# EAGLE design design-1v1 (EAGLE 9.5.1)

## Sheet 1 of 2
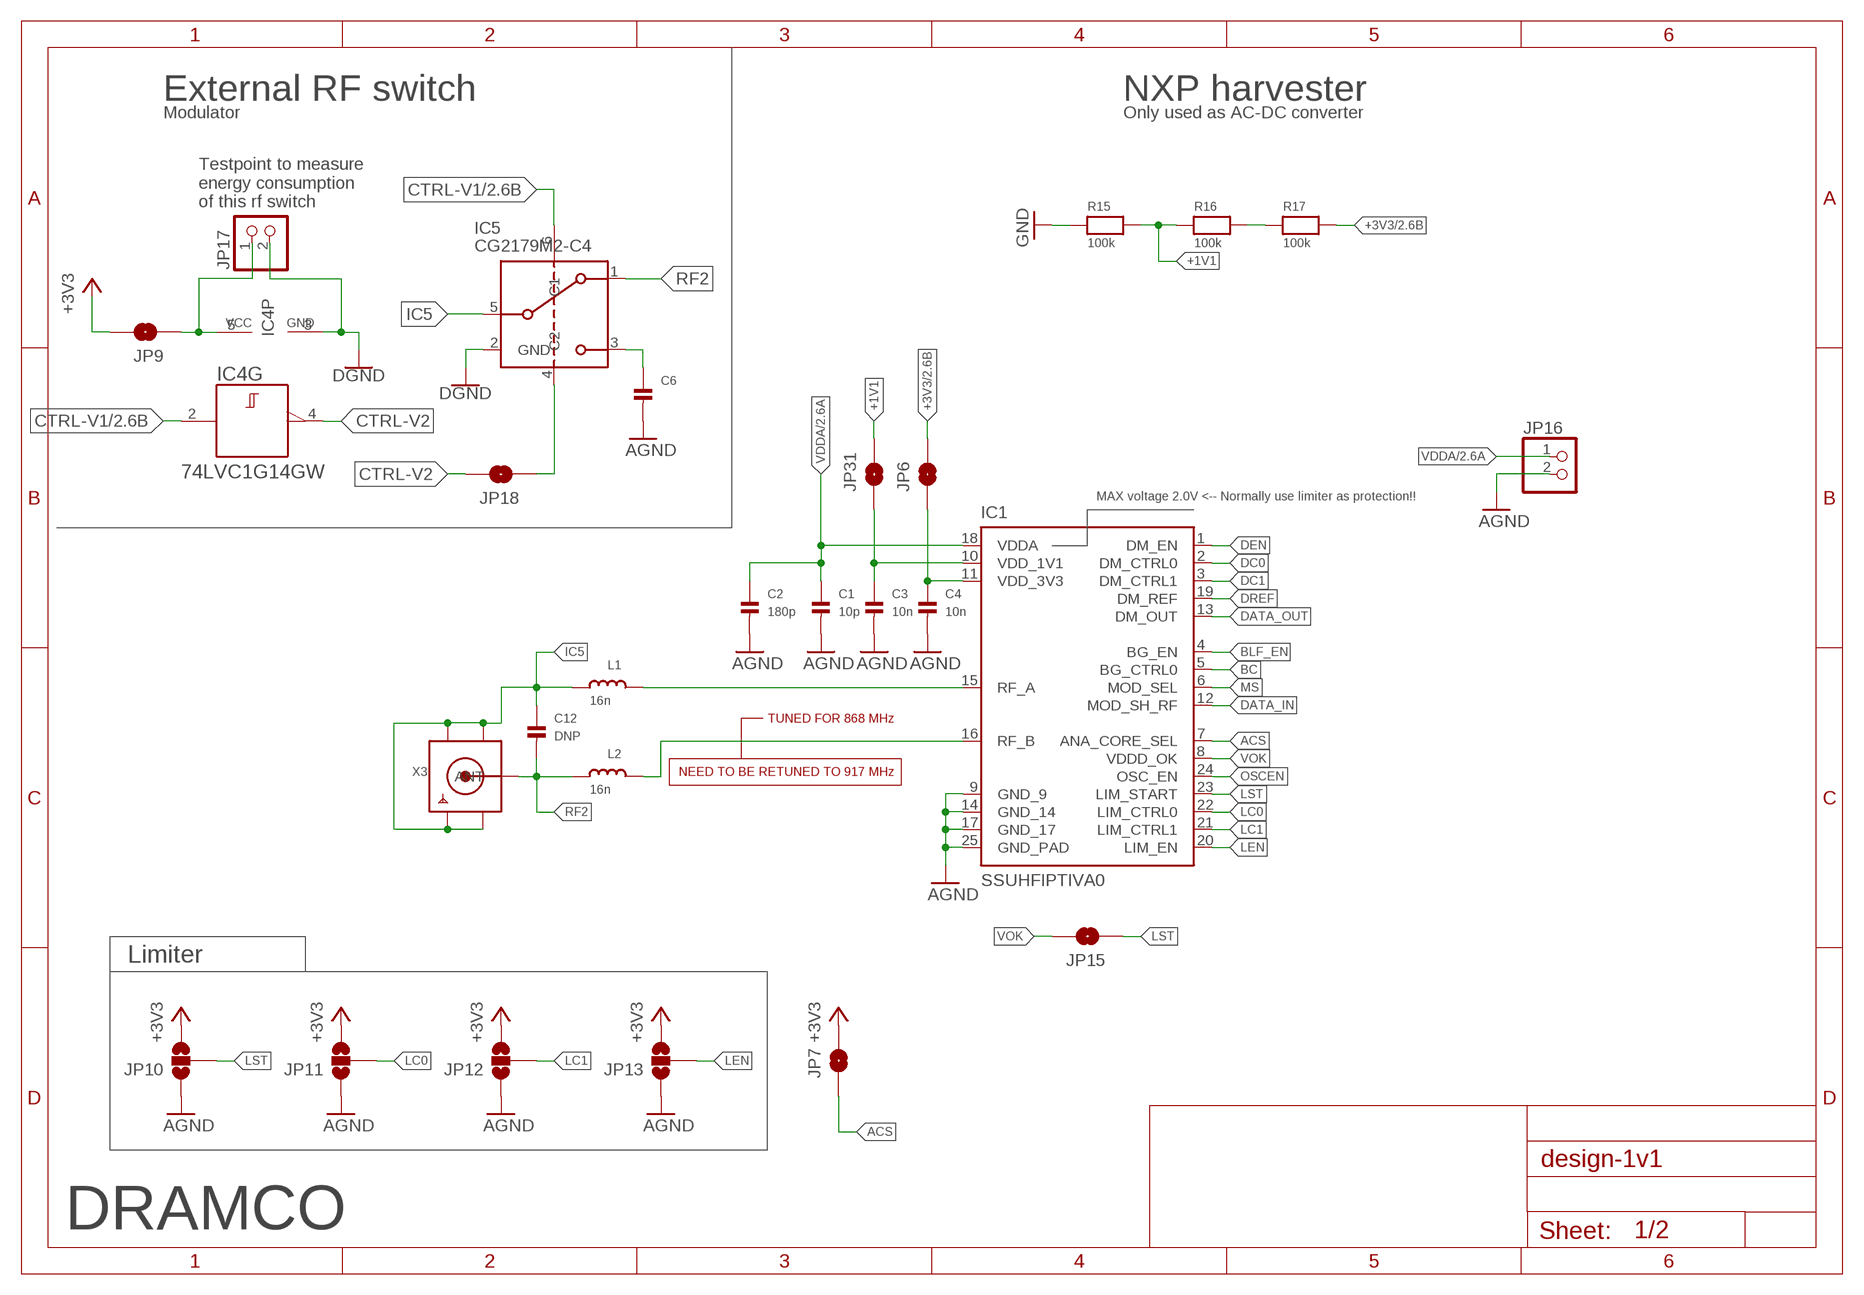
[diagram p0: schematic, sheet 1]

### Parts
C1  10p  CAP_CERAMIC0603  [0603]
C2  180p  CAP_CERAMIC0603  [0603]
C3  10n  CAP_CERAMIC0603  [0603]
C4  10n  CAP_CERAMIC0603  [0603]
C6  CAP_CERAMIC0402  [0402]
C12  DNP  CAP_CERAMIC0402  [0402]
IC1  SSUHFIPTIVA0  [QFN50P400X400X90-25N]
IC4  74LVC1G14GW  [SOT353-1]
IC5  CG2179M2-C4  [SC70-6-CNC04]
JP6  JUMPER-SMT_2_NO_NO-SILK  [SMT-JUMPER_2_NO_NO-SILK]
JP7  JUMPER-SMT_2_NO_NO-SILK  [SMT-JUMPER_2_NO_NO-SILK]
JP9  JUMPER-SMT_2_NO_NO-SILK  [SMT-JUMPER_2_NO_NO-SILK]
JP10  JUMPER-SMT_3_NO_SILK  [SMT-JUMPER_3_NO_SILK]
JP11  JUMPER-SMT_3_NO_SILK  [SMT-JUMPER_3_NO_SILK]
JP12  JUMPER-SMT_3_NO_SILK  [SMT-JUMPER_3_NO_SILK]
JP13  JUMPER-SMT_3_NO_SILK  [SMT-JUMPER_3_NO_SILK]
JP15  JUMPER-SMT_2_NO_NO-SILK  [SMT-JUMPER_2_NO_NO-SILK]
JP16  HEADER-1X2ROUND  [1X02_ROUND]
JP17  HEADER-1X2ROUND  [1X02_ROUND]
JP18  JUMPER-SMT_2_NO_NO-SILK  [SMT-JUMPER_2_NO_NO-SILK]
JP31  JUMPER-SMT_2_NO_NO-SILK  [SMT-JUMPER_2_NO_NO-SILK]
L1  16n  INDUCTOR_0402  [_0402]
L2  16n  INDUCTOR_0402  [_0402]
R15  100k  RESISTOR0603  [0603]
R16  100k  RESISTOR0603  [0603]
R17  100k  RESISTOR0603  [0603]
X3  SMACONNECTOR_EDGE_UFL  [SMA_EDGELAUNCH_UFL]

### Nets
+1V1: JP31.2 R15.2 R16.1
+3V3: JP6.2 JP7.2 JP9.2 JP10.3 JP11.3 JP12.3 JP13.3 R17.2 ; also sheet 2
ACS: IC1.7(ANA_CORE_SEL) JP7.1
AGND: C1.2 C2.2 C3.2 C4.2 C6.2 IC1.9(GND_9) IC1.14(GND_14) IC1.17(GND_17) IC1.25(GND_PAD) JP10.1 JP11.1 JP12.1 JP13.1 JP16.2 ; also sheet 2
BC: IC1.5(BG_CTRL0)
BLF_EN: IC1.4(BG_EN)
CTRL-V1: IC4.2(G:A) IC5.6(C1) ; also sheet 2
CTRL-V2: IC4.4(G:Y) JP18.2
DATA_IN: IC1.12(MOD_SH_RF)
DATA_OUT: IC1.13(DM_OUT)
DC0: IC1.2(DM_CTRL0)
DC1: IC1.3(DM_CTRL1)
DEN: IC1.1(DM_EN)
DREF: IC1.19(DM_REF)
GND: IC4.3(P:GND) IC5.2(GND) JP17.2 R15.1 ; supply symbol labelled DGND ; also sheet 2
IC5: C12.1 IC5.5(PC) L1.1 X3.GND@1(GND1) X3.GND@2(GND2) X3.GND@3(GND3) X3.GND@4(GND4)
LC0: IC1.22(LIM_CTRL0) JP11.2
LC1: IC1.21(LIM_CTRL1) JP12.2
LEN: IC1.20(LIM_EN) JP13.2
LST: IC1.23(LIM_START) JP10.2 JP15.1
MS: IC1.6(MOD_SEL)
N$2: C4.1 IC1.11(VDD_3V3) JP6.1
N$3: C3.1 IC1.10(VDD_1V1) JP31.1
N$4: IC1.15(RF_A) L1.2
N$5: IC1.16(RF_B) L2.2
N$8: IC5.4(C2) JP18.1
N$9: C6.1 IC5.3(P2)
N$14: IC4.5(P:VCC) JP9.1 JP17.1
N$17: R16.2 R17.1
OSCEN: IC1.24(OSC_EN)
RF2: C12.2 IC5.1 L2.1 X3.P(ANT)
VDDA: C1.1 C2.1 IC1.18(VDDA) JP16.1 ; also sheet 2
VOK: IC1.8(VDDD_OK) JP15.2

### Notes on the sheet
- External RF switch | NXP harvester
- Modulator | Only used as AC-DC converter
- Testpoint to measure 
  energy consumption 
  of this rf switch
- MAX voltage 2.0V <-- Normally use limiter as protection!!
- TUNED FOR 868 MHz
- NEED TO BE RETUNED TO 917 MHz
- Limiter
- DRAMCO

## Sheet 2 of 2
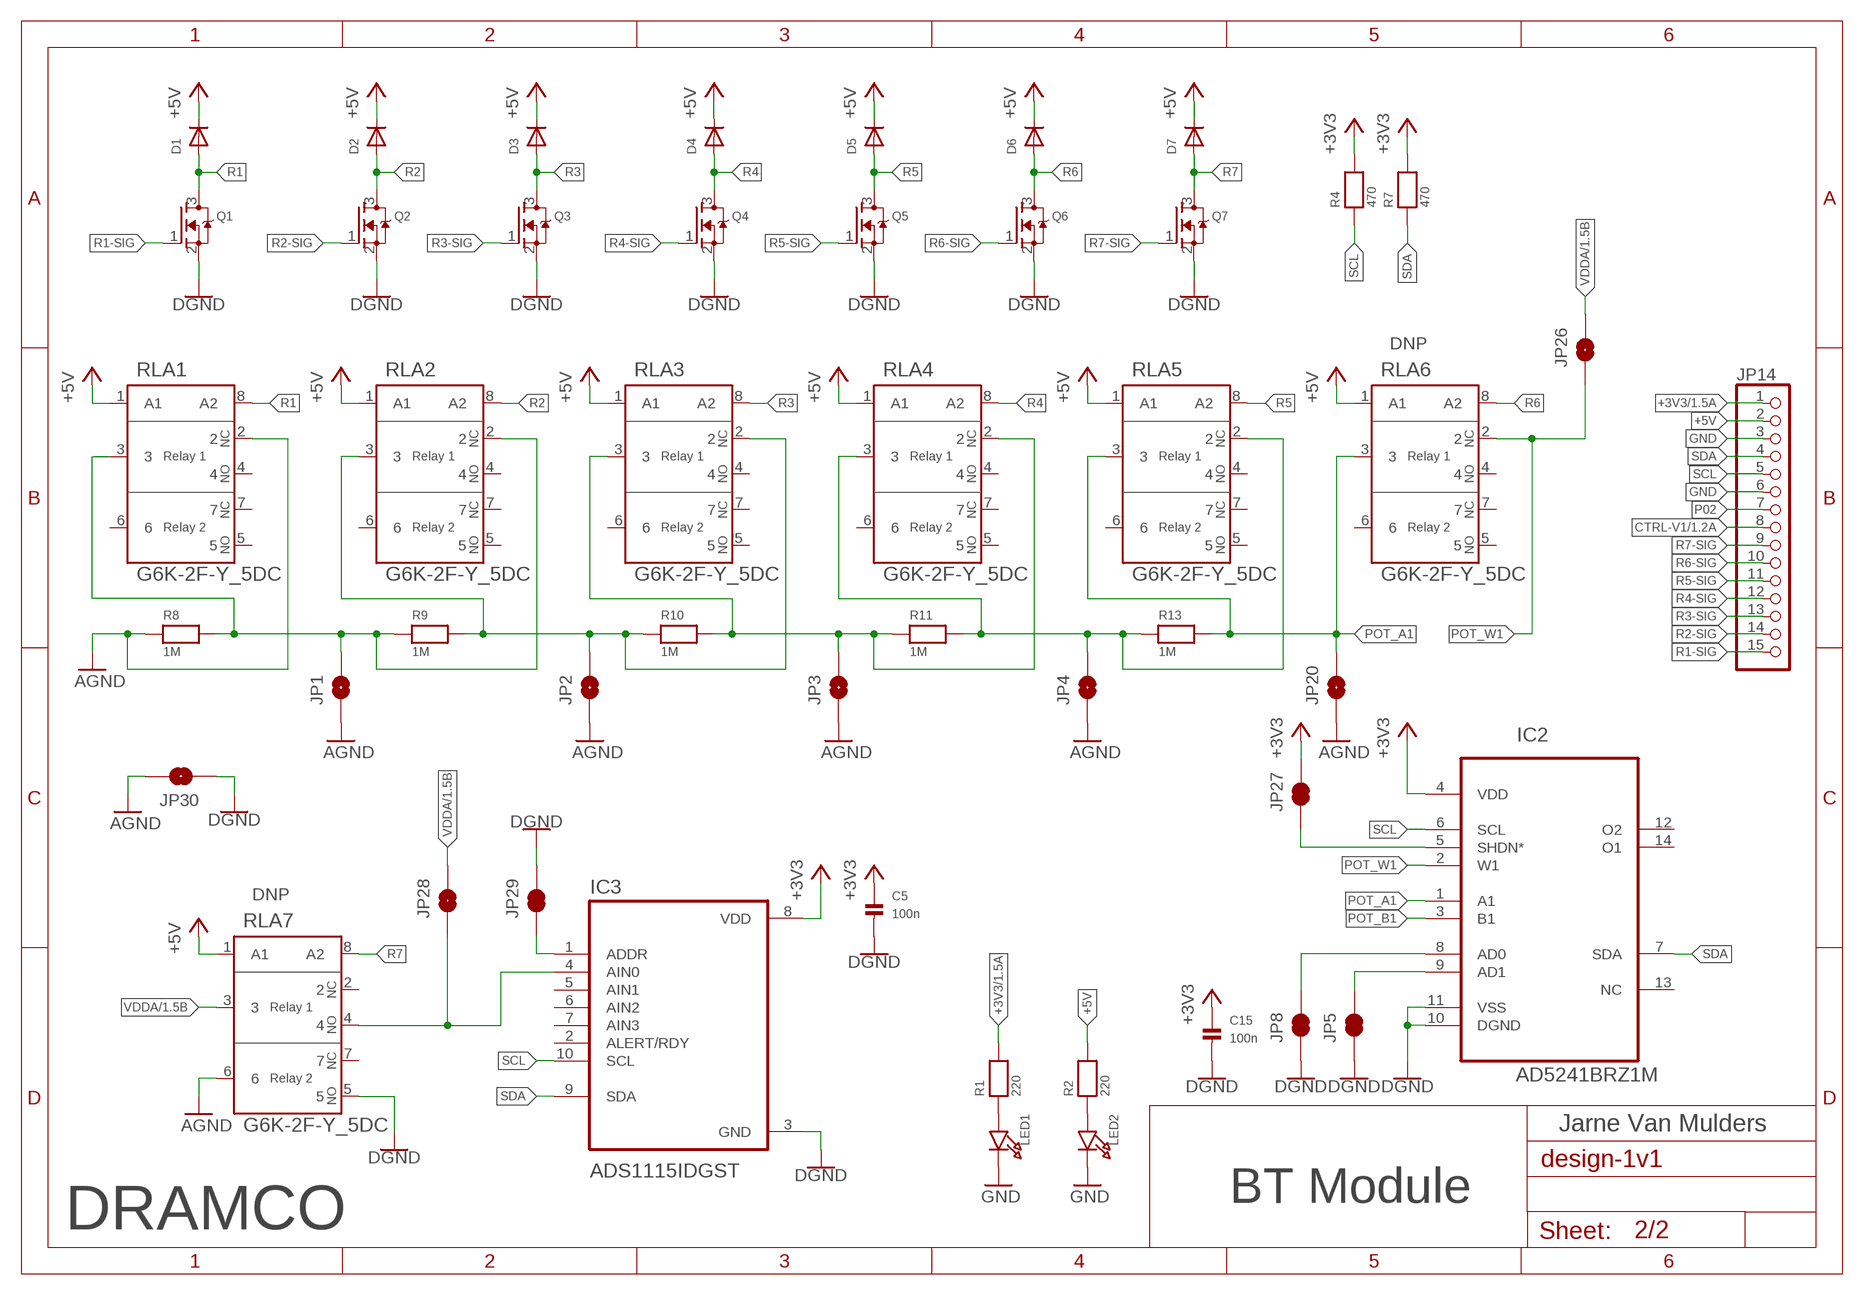
[diagram p1: schematic, sheet 2]

### Parts
C5  100n  CAP_CERAMIC0603  [0603]
C15  100n  CAP_CERAMIC0603  [0603]
D1  DIODESOD-123  [SOD-123]
D2  DIODESOD-123  [SOD-123]
D3  DIODESOD-123  [SOD-123]
D4  DIODESOD-123  [SOD-123]
D5  DIODESOD-123  [SOD-123]
D6  DIODESOD-123  [SOD-123]
D7  DIODESOD-123  [SOD-123]
IC2  AD5241BRZ1M  [SOIC127P600X175-14N]
IC3  ADS1115IDGST  [SOP50P490X110-10N]
JP1  JUMPER-SMT_2_NO_NO-SILK  [SMT-JUMPER_2_NO_NO-SILK]
JP2  JUMPER-SMT_2_NO_NO-SILK  [SMT-JUMPER_2_NO_NO-SILK]
JP3  JUMPER-SMT_2_NO_NO-SILK  [SMT-JUMPER_2_NO_NO-SILK]
JP4  JUMPER-SMT_2_NO_NO-SILK  [SMT-JUMPER_2_NO_NO-SILK]
JP5  JUMPER-SMT_2_NC_TRACE_NO-SILK  [SMT-JUMPER_2_NC_TRACE_NO-SILK]
JP8  JUMPER-SMT_2_NC_TRACE_NO-SILK  [SMT-JUMPER_2_NC_TRACE_NO-SILK]
JP14  HEADER-1X15  [1X15_ROUND_70]
JP20  JUMPER-SMT_2_NO_NO-SILK  [SMT-JUMPER_2_NO_NO-SILK]
JP26  JUMPER-SMT_2_NO_NO-SILK  [SMT-JUMPER_2_NO_NO-SILK]
JP27  JUMPER-SMT_2_NC_TRACE_NO-SILK  [SMT-JUMPER_2_NC_TRACE_NO-SILK]
JP28  JUMPER-SMT_2_NO_NO-SILK  [SMT-JUMPER_2_NO_NO-SILK]
JP29  JUMPER-SMT_2_NC_TRACE_NO-SILK  [SMT-JUMPER_2_NC_TRACE_NO-SILK]
JP30  JUMPER-SMT_2_NO_NO-SILK  [SMT-JUMPER_2_NO_NO-SILK]
LED1  LED0805  [CHIPLED_0805]
LED2  LED0805  [CHIPLED_0805]
Q1  MOSFET-NREFLOW  [SOT23-R]
Q2  MOSFET-NREFLOW  [SOT23-R]
Q3  MOSFET-NREFLOW  [SOT23-R]
Q4  MOSFET-NREFLOW  [SOT23-R]
Q5  MOSFET-NREFLOW  [SOT23-R]
Q6  MOSFET-NREFLOW  [SOT23-R]
Q7  MOSFET-NREFLOW  [SOT23-R]
R1  220  RESISTOR0603  [0603]
R2  220  RESISTOR0603  [0603]
R4  470  RESISTOR0603  [0603]
R7  470  RESISTOR0603  [0603]
R8  1M  RESISTOR0805  [0805]
R9  1M  RESISTOR0805  [0805]
R10  1M  RESISTOR0805  [0805]
R11  1M  RESISTOR0805  [0805]
R13  1M  RESISTOR0805  [0805]
RLA1  G6K-2F-Y_5DC  [RELAY_G6K-2F_OMR]
RLA2  G6K-2F-Y_5DC  [RELAY_G6K-2F_OMR]
RLA3  G6K-2F-Y_5DC  [RELAY_G6K-2F_OMR]
RLA4  G6K-2F-Y_5DC  [RELAY_G6K-2F_OMR]
RLA5  G6K-2F-Y_5DC  [RELAY_G6K-2F_OMR]
RLA6  G6K-2F-Y_5DC  [RELAY_G6K-2F_OMR]
RLA7  G6K-2F-Y_5DC  [RELAY_G6K-2F_OMR]

### Nets
+3V3: C5.1 C15.1 IC2.4(VDD) IC3.8(VDD) JP14.1 JP27.2 R1.2 R4.2 R7.2 ; also sheet 1
+5V: D1.C D2.C D3.C D4.C D5.C D6.C D7.C JP14.2 R2.2 RLA1.1(A1) RLA2.1(A1) RLA3.1(A1) RLA4.1(A1) RLA5.1(A1) RLA6.1(A1) RLA7.1(A1)
AGND: JP1.1 JP2.1 JP3.1 JP4.1 JP20.1 JP30.2 R8.1 RLA1.2 RLA7.6 ; also sheet 1
CTRL-V1: JP14.8 ; also sheet 1
GND: C5.2 C15.2 IC2.10(DGND) IC2.11(VSS) IC3.3(GND) JP5.1 JP8.1 JP14.3 JP14.6 JP29.2 JP30.1 LED1.C LED2.C Q1.2(S) Q2.2(S) Q3.2(S) Q4.2(S) Q5.2(S) Q6.2(S) Q7.2(S) RLA7.5 ; supply symbol labelled DGND ; also sheet 1
N$1: LED2.A R2.1
N$6: JP2.2 R9.2 R10.1 RLA2.3 RLA3.2
N$10: JP1.2 R8.2 R9.1 RLA1.3 RLA2.2
N$12: JP4.2 R11.2 R13.1 RLA4.3 RLA5.2
N$13: IC2.5(SHDN*) JP27.1
N$15: IC2.8(AD0) JP8.2
N$16: IC2.9(AD1) JP5.2
N$20: LED1.A R1.1
N$21: IC3.4(AIN0) JP28.1 RLA7.4
N$22: IC3.1(ADDR) JP29.1
N$24: JP3.2 R10.2 R11.1 RLA3.3 RLA4.2
P02: JP14.7
POT_A1: IC2.1(A1) JP20.2 R13.2 RLA5.3 RLA6.3
POT_B1: IC2.3(B1)
POT_W1: IC2.2(W1) JP26.1 RLA6.2
R1: D1.A Q1.3(D) RLA1.8(A2)
R1-SIG: JP14.15 Q1.1(G)
R2: D2.A Q2.3(D) RLA2.8(A2)
R2-SIG: JP14.14 Q2.1(G)
R3: D3.A Q3.3(D) RLA3.8(A2)
R3-SIG: JP14.13 Q3.1(G)
R4: D4.A Q4.3(D) RLA4.8(A2)
R4-SIG: JP14.12 Q4.1(G)
R5: D5.A Q5.3(D) RLA5.8(A2)
R5-SIG: JP14.11 Q5.1(G)
R6: D6.A Q6.3(D) RLA6.8(A2)
R6-SIG: JP14.10 Q6.1(G)
R7: D7.A Q7.3(D) RLA7.8(A2)
R7-SIG: JP14.9 Q7.1(G)
SCL: IC2.6(SCL) IC3.10(SCL) JP14.5 R4.1
SDA: IC2.7(SDA) IC3.9(SDA) JP14.4 R7.1
VDDA: JP26.2 JP28.2 RLA7.3 ; also sheet 1
Unconnected: IC2.12(O2) IC2.13(NC) IC2.14(O1) IC3.2(ALERT/RDY) IC3.5(AIN1) IC3.6(AIN2) IC3.7(AIN3) RLA1.4 RLA1.5 RLA1.6 RLA1.7 RLA2.4 RLA2.5 RLA2.6 RLA2.7 RLA3.4 RLA3.5 RLA3.6 RLA3.7 RLA4.4 RLA4.5 RLA4.6 RLA4.7 RLA5.4 RLA5.5 RLA5.6 RLA5.7 RLA6.4 RLA6.5 RLA6.6 RLA6.7 RLA7.2 RLA7.7

### Notes on the sheet
- DNP
- DNP
- Jarne Van Mulders
- BT Module
- DRAMCO

## Library data of the parts
C1-C6 C12 C15 = microbuilder:CAP_CERAMIC: Ceramic Capacitors 0402 - 0402 Surface Mount Capacitors 16pF 50V 5% [Digikey: 445-4899-2-ND] 18pF 50V 5% [Digikey: 490-1281-2-ND] 22pF 50V 5% [Digikey: 490-1283-2-ND] 68pF 50V 5% [Digikey: 490-1289-2-ND] 0.1uF 10V 10% [Digikey: 490-1318-2-ND] 1.0uF 6.3V 10% [Digikey: 490-1320-2-ND] 0603 - 0603 Surface Mount Capacitors 16 pF 50V 5% [Digikey: 445-5051-2-ND] 22 pF 50V [Digikey: PCC220ACVTR-ND] 33 pF 50V 5% [Digikey: 490-1415-1-ND] 56pF 50V 5% [Digikey: 490-1421-1-ND] 220pF 50V 5% [Digikey: 445-1285-1-ND] 680 pF 50V 2200 pF 50V 5% C0G [Digikey: 445-1297-1-ND] 5600 pF 100V 5% X7R [Digikey: 478-3711-1-ND] 0.1 µF 25V 10% [Digikey: PCC2277TR-ND] 0.22 µF 16V 10% X7R [Digikey: 445-1318-1-ND] 1.0 µF 25V 10% [Digikey: 445-5146-2-ND] 0603 - RF Specific 3pF 250V +/-0.1pF RF [Digikey: 712-1347-1-ND] 18 pF 250V 5% [Digikey: 478-3505-1-ND or 712-1322-1-ND] 56 pF 250V 5% C0G RF [Digikey: 490-4867-1-ND] 68 pF 250V RF [Digikey: 490-4868-1-ND] 0805 - 0805 Surface Mount Capacitors 220 pF 250V 2% RF Ceramic Capacitor [Digikey: 712-1398-1-ND] 1000 pF 50V 2% NP0 Ceramic Capacitor [Digikey: 478-3760-1-ND] 0.1 µF 25V 10% Ceramic Capacitor [Digikey: PCC1828TR-ND] 1.0 µF 16V 10% Ceramic Capacitor[Digikey: 490-1691-2-ND] 10.0 µF 10V 10% Ceramic Capacitor[Digikey: 709-1228-1-ND] 10.0 uF 16V 10% Ceramic Capacitor [Digikey: 478-5165-2-ND] 47 uF 6.3V 20% Ceramic Capacitor [Digikey: 587-1779-1-ND or 399-5506-1-ND] 1206 - 1206 Surface Mount Capacitors 47uF 10V 20% Ceramic Capacitor [Digikey: 490-5528-1-ND or 399-5508-1-ND or 445-6010-1-ND] 100uF 6.3V -20%, +80% Y5V Ceramic Capacitor (Digikey: 490-4512-1-ND, Mouser: 81-GRM31CF50J107ZE1L)
D1-D7 = microbuilder:DIODE: Diode SMA Model Volts Amps Type Vf Vr Digikey # Notes SSA34-E3 40V 3A Schottky 480mV @ 3A 200uA @ 40V SSA34-E3/61TGITR-ND CDBA120-G 20V 1A Schottky 500mV @ 1A 500uA @ 20V 641-1014-6-ND REEL MBRA210 10V 2A Schottky 350mV @ 2A 700uA @ 10V MBRA210LT3 SOD-123 Model Volts Amps Type Vf Vr Order # Notes BAT54T1G 30V 200mA Schottky 800mV @ 200mA 2uA @ 25V BAT54T1GOSTR-ND B0530W 30V 500mA Schottky 430mV @ 500mA 130uA @ 30V B0530W-FDICT-ND REEL MBR120 1A 20V Schottky 340mV @ 1A MBR120VLSFT1GOSCT-ND SOD-323 Model Volts Amps Type Vf Vr Order # Notes PMEG2005EJ 20V 500mA Schottky 355mV @ 500mA 568-4110-1-ND ZLLS410 10V 570mA Schottky 380mV @ 570mA ZLLS410CT-ND 1N4148WS 75V 150mA Silicon/Simple 1V 1N4148WSFSCT-ND REEL SOD-523 Model Volts Amps Type Vf Vr Order # Notes BAT54XV2 30V 200mA Schottky 0.8V @ 100mA BAT54XV2CT-ND TB751S 30V 30mA Schottky RB751S-40TE61CT-ND SOT23-R/W (R = Solder Paste/Reflow Ovens, W = Hand-Soldering) Model Volts Amps Type Vf Vr Order # Notes BAT54FILM 40V 300mA Schottky 497-7162-1-ND
IC1 = sSUHFIPTIVA0:SSUHFIPTIVA0
IC2 = AD5241BRZ1M:AD5241BRZ1M: I2C Compatible Digital Potentiometer Check availability <https://pricing.snapeda.com/parts/AD5241BRZ1M/Analog%20Devices/view-part?ref=eda>; AVAILABILITY: In Stock; CHECK_PRICES: https://www.snapeda.com/parts/AD5241BRZ1M/Analog+Devices/view-part/?ref=eda; DESCRIPTION: I2C Compatible Digital Potentiometer; MF: Analog Devices; MP: AD5241BRZ1M; PACKAGE: SOIC-14 Analog Devices; PRICE: None; SNAPEDA_LINK: https://www.snapeda.com/parts/AD5241BRZ1M/Analog+Devices/view-part/?ref=snap
IC3 = ADS1115IDGST:ADS1115IDGST: Check prices <https://pricing.snapeda.com/parts/ADS1115IDGST/Texas%20Instruments/view-part?ref=eda>; AVAILABILITY: Good; DESCRIPTION: 16-Bit 860SPS 4-Ch Delta-Sigma ADC With PGA, Oscillator, Vref, Comparator, and I2C 10-VSSOP -40 to 125; MF: Texas Instruments; MP: ADS1115IDGST; PACKAGE: VSSOP-10 Texas Instruments; PRICE: None; PURCHASE-URL: https://pricing.snapeda.com/search/part/ADS1115IDGST/?ref=eda
IC4 = nxp_60_1_1:74LVC1G14: Single Schmitt-trigger inverter The 74LVC1G14 provides the inverting buffer function with Schmitt-trigger input. It is capable of transforming slowly changing input signals into sharply defined, jitter-free output signals. The input can be driven from either 3.3 V or 5 V devices. This feature allows the use of this device in a mixed 3.3 V and 5 V environment. Schmitt-trigger action at the input makes the circuit tolerant for slower input rise and fall time. This device is fully specified for partial power-down applications using IOFF. The IOFF circuitry disables the output, preventing the damaging backflow current through the device when it is powered down. AAL Eindhoven MK; 12NC: 9352 685 95125
IC5 = CG2179M2-C4:CG2179M2-C4: Check availability <https://pricing.snapeda.com/parts/CG2179M2-C4/CEL/view-part?ref=eda>; AVAILABILITY: In Stock; CHECK_PRICES: https://www.snapeda.com/parts/CG2179M2-C4/CEL/view-part/?ref=eda; DESCRIPTION: RF Switch IC 802.11b/g/n/ac SPDT 3 GHz 50Ohm 6-Minimold; MF: CEL; MP: CG2179M2-C4; PACKAGE: SMD-6 CEL; PRICE: None; SNAPEDA_LINK: https://www.snapeda.com/parts/CG2179M2-C4/CEL/view-part/?ref=snap
JP1-JP4 JP6 JP7 JP9 JP15 JP18 JP20 JP26 JP28 JP30 JP31 = SparkFun-Jumpers:JUMPER-SMT_2_NO: Normally open jumper This jumper has two pads in close proximity to each other. Apply solder to close the connection. Round pads are easier to solder for beginners, but are a lot larger. SparkFun Product that uses the round pads: SparkFun EL Sequencer <https://www.sparkfun.com/products/12781>
JP5 JP8 JP27 JP29 = SparkFun-Jumpers:JUMPER-SMT_2_NC_TRACE: Normally closed trace jumper This jumper has a trace between two pads so it's normally closed (NC). Use a razor knife to open the connection. For best results follow the IPC guidelines for cutting traces: Cutout at least 0.063 mm (0.005 in). Remove all loose material to clean up the cut area. Seal the cut with an approved epoxy. Reapply solder to reclose the connection.
JP10-JP13 = SparkFun-Jumpers:JUMPER-SMT_3_NO: Normally open jumper This jumper has three pads in close proximity to each other. Apply solder to close the connection(s).
JP14 = microbuilder:HEADER-1X15: 1x15 Header
JP16 JP17 = microbuilder:HEADER-1X2: PIN HEADER
L1 L2 = microbuilder:INDUCTOR: Inductors 0603: 10nH Ceramic Inductor - microwire antenna/RF (Digikey: 712-1434-2-ND) 0805: 560nH Ceramic Inductor - RF (Digikey: 553-1047-1-ND) 270nH Ceramic Inductor - Q = 40@250MHz, +-5%, 1 Ohm DC Resistance (Digikey: 535-10506-2-ND) 1007 (2518 Metric) SMT: 10µH 10% 250mOhm 820mA 1007 Inductor (Digikey: 587-2189-1-ND) 22µH 10% 500mOhm 580mA 1007 Inductor (Digikey: 587-2190-1-ND) 47µH 10% 950mOhm 420mA 1007 Inductor (Digikey: 587-2191-1-ND) 47µH 5% 100mOhm 1A 1008 Inductor (Digikey: 732-1816-1-ND) 5.0x5.0mm (Taiyo Yuden NR5040 Series) 6.8µH 20% 2.3A 64mOhm Inductor (Digikey: 587-2374-2-ND) 5.0x5.0mm (TDK VLC5045 Series) 4.7µH 20% 3.3A 34mOhm Inductor (Digikey: 445-6526-1-ND) 6.8µH 20% 2.7A 46mOhm Inductor (Digikey: 445-6527-1-ND) 6.0x6.0mm (TDK VLC6045 Series) 4.7µH 20% 3.8A 27mOhm Inductor (Digikey: 445-6538-2-ND) 6.8µH 20% 3A 41mOhm Inductor (Digikey: 445-6540-1-ND) 6.2µH 30% 2.2A 45mOhm Inductor (Digikey: SRR5028-6R2YCT-ND) - Not TDK VLC6045 but footprint should match 6.0x6.0mm (TDK SLF6045 Series) 6.8uH 30% 2A 33mOhm Inductor (Digikey: 445-4572-1-ND, Mouser: 810-SLF645T6R8N2R0PF)
LED1 LED2 = microbuilder:LED: LED 0603 - 0603 Surface Mount Package 2mA: Green LED - Low Power (3.9mcd, 2ma, 1.7Vf) - Digikey: 475-2709-2-ND Orange LED - Low Power (9.8mcd, 2ma, 1.8Vf) - Digikey: 475-1194-2-ND Red LED - Low Power (5mcd, 2ma, 1.8Vf) - Digikey: 475-1195-2-ND Yellow LED - Low Power (7mcd, 2ma, 1.8Vf) - Digikey: 475-1196-2-ND 5mA: Blue LED - Low Power (17mcd, 5ma, 2.9Vf) - Digikey: LNJ937W8CRACT-ND 0805 - 0805 Surface Mount Package 2mA: Red LED (8.8mcd, 2mA, 1.8Vf, Clear) - Low Power [Digikey: 475-2510-1-ND] Green LED (5mcd, 2mA, 1.8Vf, Clear) - Low Power [Digikey: 475-2730-1-ND] Yellow LED (11.3mcd, 2mA, 1.8Vf, Clear) - Low Power [Digikey: 475-2555-1-ND] 20mA: Red LED (104mcd, 20mA, Diffused) - LS R976 [Digikey: 475-1278-6-ND] Red LED (12mcd, 20mA, 2.0Vf, Clear) - APT2012EC [Digikey: 754-1128-1-ND] Green LED (15mcd, 20mA, 2.2Vf, Clear) - APT2012GC [Digikey: 754-1131-1-ND] Orange LED (160mcd, 20mA, 2.1Vf, Clear) - APT2012SECK [Digikey: 754-1130-1-ND] 1206 - 1206 Surface Mount Package Green LED (26mcd, 20mA, Diffused) - LG N971 [Digikey: 475-1407-6-ND] Red LED (15mcd, 20mA, Diffused) - LH N974 [Digikey: 475-1416-6-ND]
Q1-Q7 = microbuilder:MOSFET-N: N-Channel Mosfet LEGEND VDS: Voltage Drain-Source ID: Drain Current RDS(ON): Drain-Source On-State Resistance VGS(TH): Gate-Source Threshold Voltage CISS: Drain-Source Input Capacitance SOT-23 Name VDS ID RDS(ON) VGS(TH) CISS Order Number 2N7002E 60V 260mA 2.5 Ohm 2.5V @ 250uA 26.7pF @ 25V 2N7002ET1GOSTR-ND BSH103 30V 850mA 400 mOhm 400mV @ 1mA 83pF @ 24V BSH103,235-ND BSS138 60V 320mA 1.6 Ohm 1.5V @ 250uA 50pF @ 10V Mouser: 771-BSS138PW115 DMN2075U-7 20V 4.2A 38 mOhm 1V @ 250 uA 594.3pF @ 10V DMN2075U-7DICT-ND * BSS138 good choice for I2C level-shifting
R1 R2 R4 R7-R11 R13 R15-R17 = microbuilder:RESISTOR: Resistors 0402 - 0402 Surface Mount Package 22 Ohm 1% 1/16W [Digikey: 311-22.0LRTR-ND] 33 Ohm 5% 1/16W 1.0K 5% 1/16W 1.5K 5% 1/16W 2.0K 1% 1/16W 10.0K 1% 1/16W [Digikey: 311-10.0KLRTR-ND] 10.0K 5% 1/16W [Digikey: RMCF0402JT10K0TR-ND] 12.1K 1% 1/16W [Digikey: 311-22.0LRTR-ND] 100.0K 5% 1/16W 0603 - 0603 Surface Mount Package 0 Ohm 1/10 Watt 1% Resistor 15 Ohm 1/10 Watt 1% Resistor 33 Ohm 1/10 Watt 1% Resistor 49.9 Ohm 1/10 Watt 1% Resistor 100 Ohm 1/10 Watt 1% Resistor 150 Ohm 1/10 Watt 1% Resistor 240 Ohm 1/10 Watt 1% Resistor 390 Ohm 1/10 Watt 1% Resistor 560 Ohm 1/10 Watt 1% Resistor 680 Ohm 1/10 Watt 1% Resistor 750 Ohm 1/10 Watt 1% Resistor 1.0K Ohm 1/10 Watt 1% Resistor 1.5K Ohm 1/10 Watt 1% Resistor 2.0K Ohm 1/10 Watt 1% Resistor 2.2K Ohm 1/10 Watt 1% Resistor 3.3K Ohm 1/10 Watt 1% Resistor 4.7K Ohm 1/10 Watt 1% Resistor 10.0K Ohm 1/10 Watt 1% Resistor 12.0K Ohm 1/10 Watt 1% Resistor 12.1K Ohm 1/10 Watt 1% Resistor 20.0K Ohm 1/10 Watt 1% Resistor 33.0K Ohm 1/10 Watt 1% Resistor 100.0K Ohm 1/10 Watt 1% Resistor 0805 - 0805 Surface Mount Package 0 Ohm 1/8 Watt 1% Resistor 33 Ohm 1/8 Watt 1% Resistor 100 Ohm 1/8 Watt 1% Resistor 150 Ohm 1/8 Watt 1% Resistor 200 Ohm 1/8 Watt 1% Resistor 240 Ohm 1/8 Watt 1% Resistor 330 Ohm 1/8 Watt 1% Resistor 390 Ohm 1/8 Watt 1% Resistor 470 Ohm 1/8 Watt 1% Resistor 1.0K Ohm 1/8 Watt 1% Resistor 1.5K Ohm 1/8 Watt 1% Resistor 2.0K Ohm 1/8 Watt 1% Resistor 4.7K Ohm 1/8 Watt 1% Resistor 5.1K Ohm 1/8 Watt 1% Resistor 5.6K Ohm 1/8 Watt 1% Resistor 10.0K Ohm 1/8 Watt 1% Resistor 22.0K Ohm 1/8 Watt 1% Resistor 33.0K Ohm 1/8 Watt 1% Resistor 100K Ohm 1/8 Watt 1% Resistor 1206 - 1206 Surface Mount Package 2012 - 2010 Surface Mount Package 0.11 Ohm 1/2 Watt 1% Resistor - Digikey: RHM.11UCT-ND
RLA1-RLA7 = G6K-2F-Y 5DC:G6K-2F-Y_5DC; COPYRIGHT: Copyright (C) 2024 Ultra Librarian. All rights reserved.; MANUFACTURER_PART_NUMBER: G6K-2F-Y 5DC; MFR_NAME: Omron
X3 = adafruit:SMACONNECTOR: SMA Connector 90° DIP SMA Connector, 50 Ohm (4UConnector: 07259)

## Board
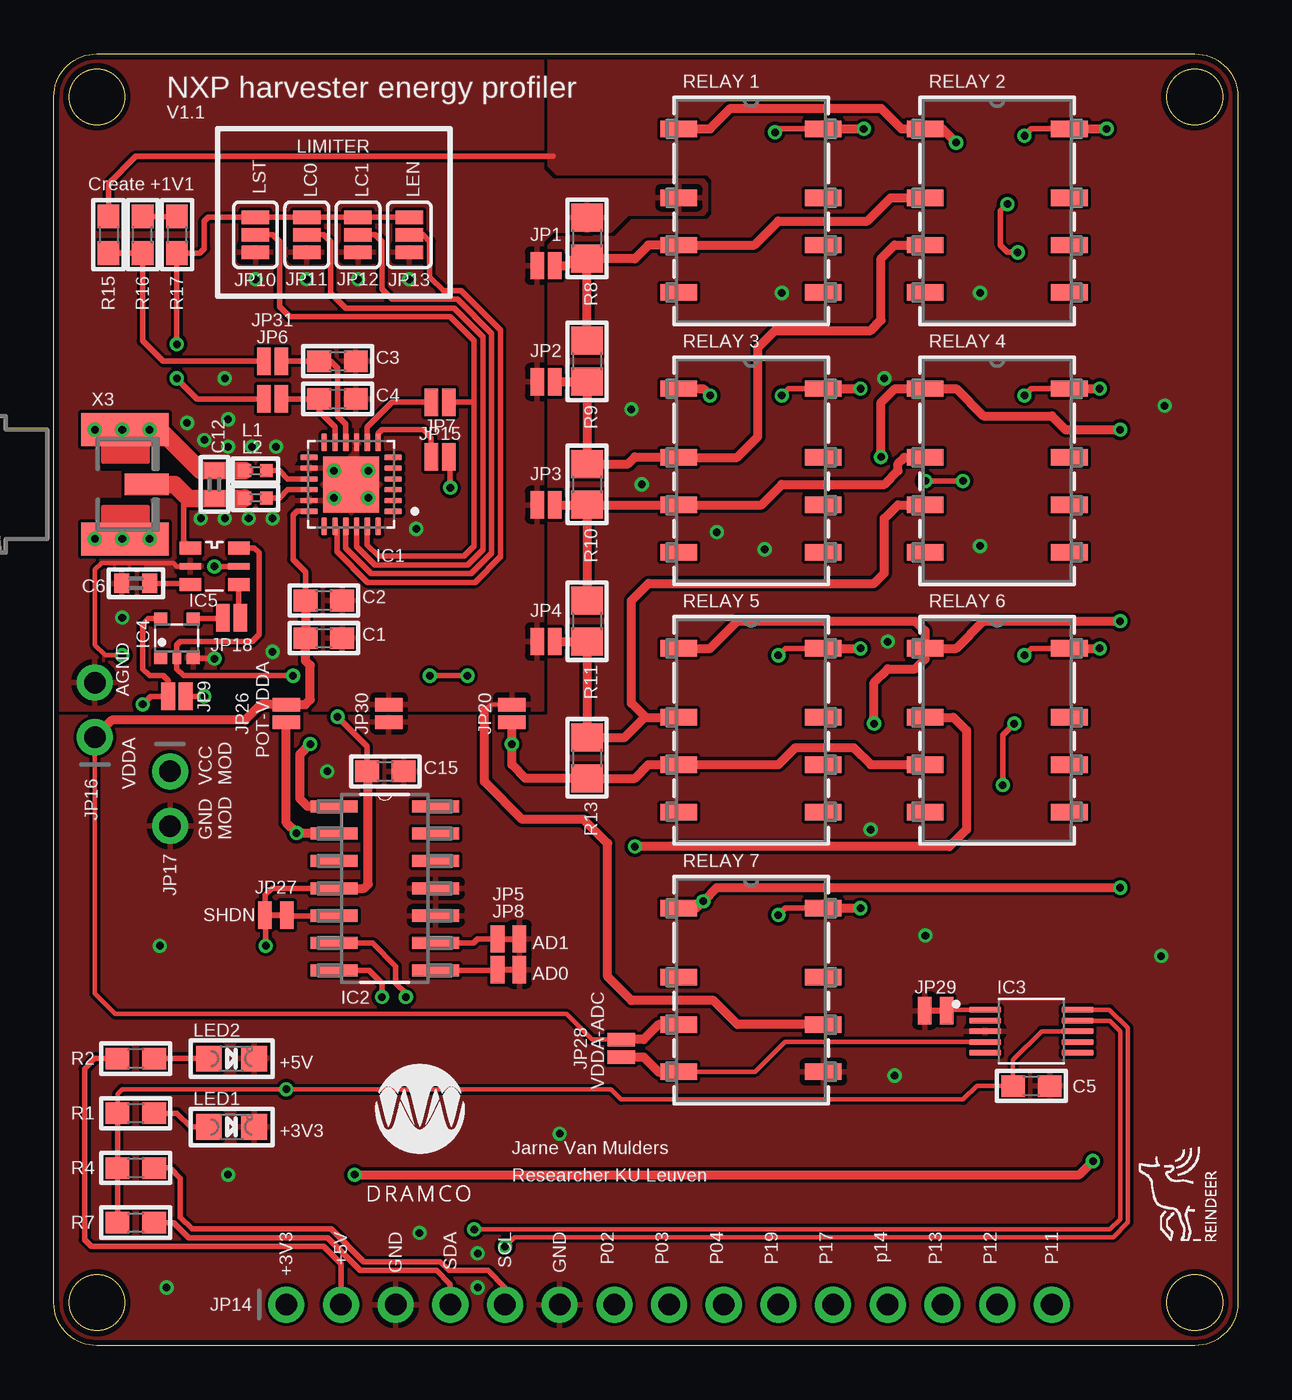
[diagram p2: board, top side]
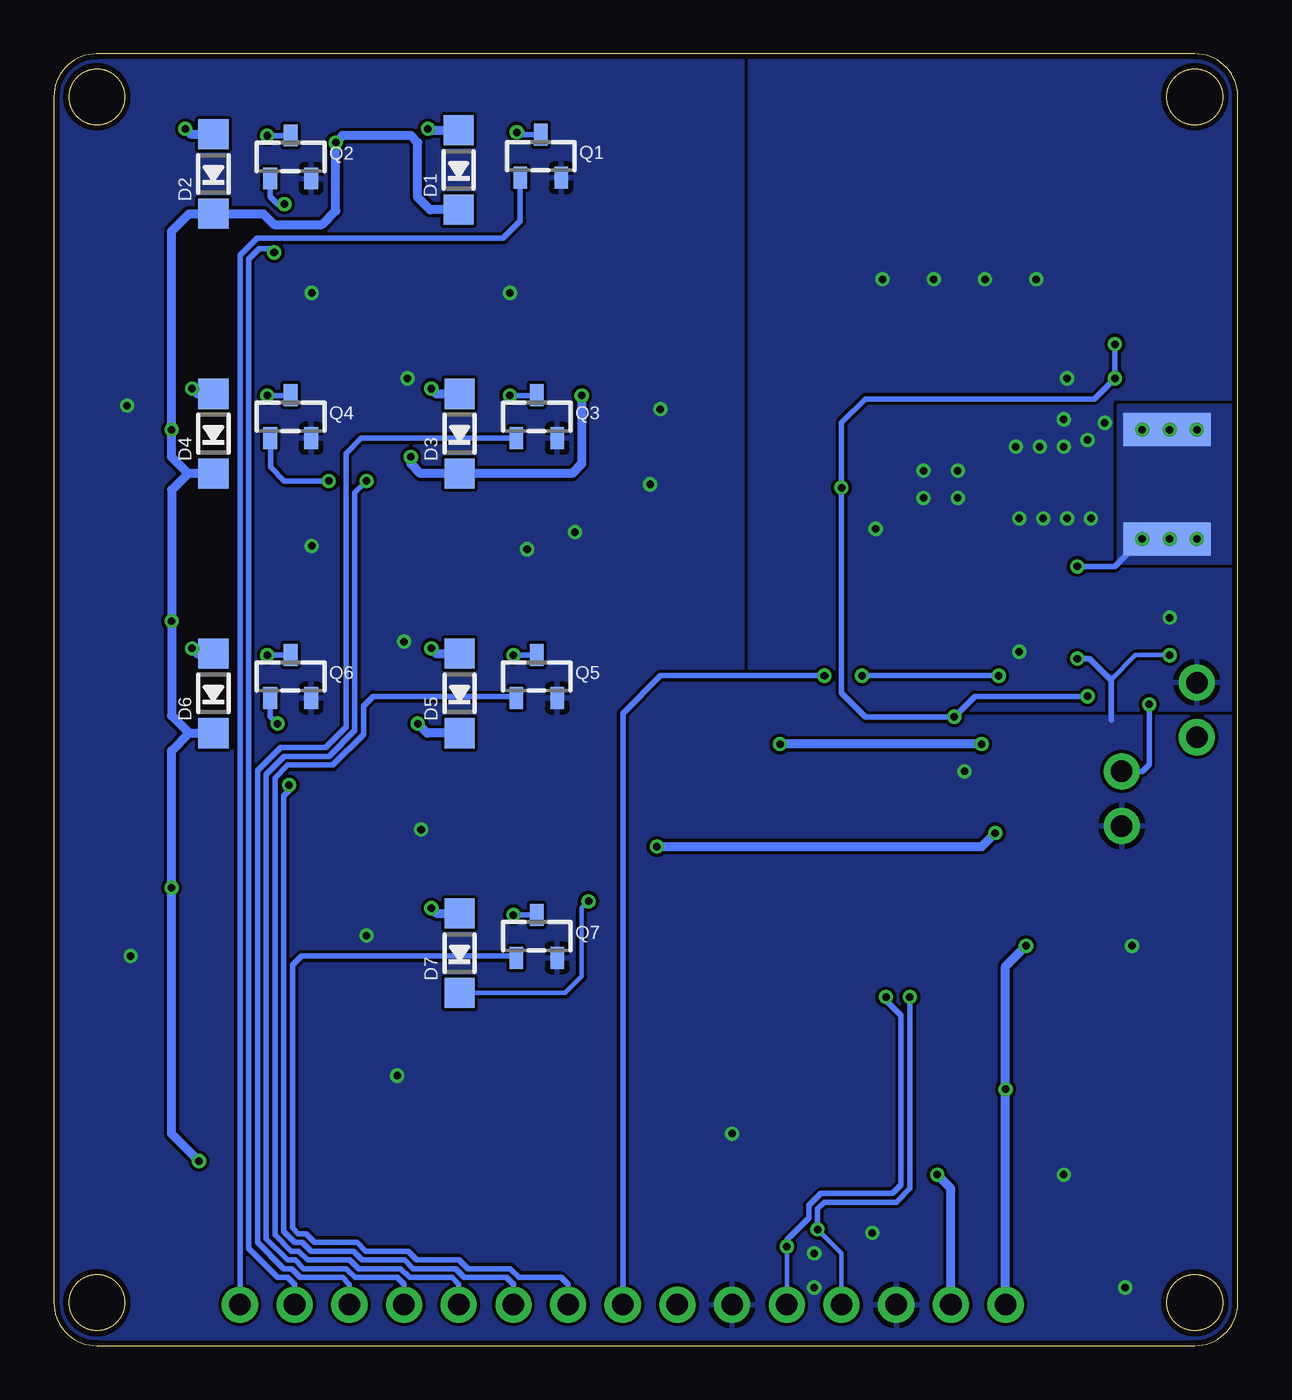
[diagram p3: board, bottom side, seen from below]

Size 55 x 60 mm. Coordinates in mm from the lower left corner, seen from the top.
Outline: 0,2 0,58 arc-90 2,60 53,60 arc-90 55,58 55,2 arc-90 53,0 2,0 arc-90 0,2
Outline: circle at 2,58 radius 1.3
Outline: circle at 2,2 radius 1.3
Outline: circle at 53,58 radius 1.3
Outline: circle at 53,2 radius 1.3
Copper layers (1*16): Top 0.035mm / dielectric 1.5mm / Bottom 0.035mm
Design rules "SeeedStudio_2layer_DRU_no_angle_20140221": minimum track width 6mil, minimum drill 12mil, track to track 6mil, track to pad 6mil, pad to pad 6mil, via to via 6mil, smd to smd 0mil, copper to edge 10mil, drill to drill 10mil, minimum pad ring 10mil, minimum via ring 6mil, stop-mask expansion 2mil, vias tented up to drill 100mil, thermal gap 10mil

### Footprints (pad centres in the part's own frame; a part is rotated, then mirrored left to right if it is on the bottom)
0603 = smd 1.1 x 1: 1 -0.85,0; 2 0.85,0
0402 = smd 0.7 x 0.9: 1 -0.65,0; 2 0.65,0
SOD-123 = smd 1.4 x 1.4: A 1.85,0; C -1.85,0
QFN50P400X400X90-25N = smd 0.81 x 0.26: 1 -1.95,1.25; 2 -1.95,0.75; 3 -1.95,0.25; 4 -1.95,-0.25; 5 -1.95,-0.75; 6 -1.95,-1.25; 13 1.95,-1.25; 14 1.95,-0.75; 15 1.95,-0.25; 16 1.95,0.25; 17 1.95,0.75; 18 1.95,1.25 | smd 0.26 x 0.81: 7 -1.25,-1.95; 8 -0.75,-1.95; 9 -0.25,-1.95; 10 0.25,-1.95; 11 0.75,-1.95; 12 1.25,-1.95; 19 1.25,1.95; 20 0.75,1.95; 21 0.25,1.95; 22 -0.25,1.95; 23 -0.75,1.95; 24 -1.25,1.95 | smd 2.6 x 2.6: 25 0,0
SOIC127P600X175-14N = smd 2.184 x 0.559: 1 -2.362,3.81; 2 -2.362,2.54; 3 -2.362,1.27; 4 -2.362,0; 5 -2.362,-1.27; 6 -2.362,-2.54; 7 -2.362,-3.81; 8 2.362,-3.81; 9 2.362,-2.54; 10 2.362,-1.27; 11 2.362,0; 12 2.362,1.27; 13 2.362,2.54; 14 2.362,3.81
SOP50P490X110-10N = smd 1.47 x 0.28: 1 -2.15,1; 2 -2.15,0.5; 3 -2.15,0; 4 -2.15,-0.5; 5 -2.15,-1; 6 2.15,-1; 7 2.15,-0.5; 8 2.15,0; 9 2.15,0.5; 10 2.15,1
SOT353-1 = smd 0.6 x 0.6: 1 -0.75,-0.9; 3 0.75,-0.9; 4 0.75,0.9; 5 -0.75,0.9 | smd 0.4 x 0.6: 2 0,-0.9
SC70-6-CNC04 = smd 1 x 0.6: 1 -1.125,0.85; 3 -1.125,-0.85; 4 1.125,-0.85; 6 1.125,0.85 | smd 1 x 0.3: 2 -1.125,0; 5 1.125,0
SMT-JUMPER_2_NO_NO-SILK = smd 0.635 x 1.27: 1 -0.406,0; 2 0.406,0
SMT-JUMPER_2_NC_TRACE_NO-SILK = smd 0.635 x 1.27: 1 -0.508,0; 2 0.508,0
SMT-JUMPER_3_NO_SILK = smd 0.635 x 1.27: 1 -0.813,0; 2 0,0; 3 0.813,0
1X15_ROUND_70 = drill 1 pad 1.676: 1 -17.78,0; 2 -15.24,0; 3 -12.7,0; 4 -10.16,0; 5 -7.62,0; 6 -5.08,0; 7 -2.54,0; 8 0,0; 9 2.54,0; 10 5.08,0; 11 7.62,0; 12 10.16,0; 13 12.7,0; 14 15.24,0; 15 17.78,0
1X02_ROUND = drill 1 pad 1.676: 1 -1.27,0; 2 1.27,0
_0402 = smd 0.6 x 0.6: 1 -0.508,0; 2 0.508,0
CHIPLED_0805 = smd 1.2 x 1.2: A 0,-1.05; C 0,1.05
SOT23-R = smd 0.635 x 1.016: 1 -0.95,-1; 2 0.95,-1; 3 0,1
0805 = smd 1.3 x 1.5: 1 -0.95,0; 2 0.95,0
RELAY_G6K-2F_OMR = smd 1.702 x 0.762: 1 -3.353,3.81; 2 -3.353,0.61; 3 -3.353,-1.59; 4 -3.353,-3.79; 5 3.353,-3.79; 6 3.353,-1.59; 7 3.353,0.61; 8 3.353,3.81
SMA_EDGELAUNCH_UFL = smd 4.064 x 1.524: GND@1 2.032,-2.54; GND@2 2.032,2.54 | smd 4.064 x 1.524 bottom: GND@3 2.032,2.54; GND@4 2.032,-2.54 | smd 2.032 x 1.016: P 3.048,0

### Placement (x,y rotation side)
C1  12.54,32.86 0 top
C2  12.54,34.61 0 top
C3  13.18,45.72 0 top
C4  13.18,43.97 0 top
C5  45.4,12.06 0 top
C6  3.81,35.4 180 top
C12  7.46,40.01 270 top
C15  15.4,26.67 0 top
D1  36.2,54.61 90 bottom
D2  47.59,54.42 90 bottom
D3  36.16,42.36 90 bottom
D4  47.59,42.36 90 bottom
D5  36.16,30.3 90 bottom
D6  47.59,30.3 90 bottom
D7  36.16,18.23 90 bottom
IC1  13.81,40.01 180 top
IC2  15.37,21.24 0 top
IC3  45.4,14.61 0 top
IC4  5.71,32.86 0 top
IC5  7.46,36.2 0 top
JP1  22.86,50.16 0 top
JP2  22.86,44.77 0 top
JP3  22.86,39.05 0 top
JP4  22.86,32.7 0 top
JP5  21.11,18.89 180 top
JP6  10.16,43.97 180 top
JP7  17.94,41.27 0 top
JP8  21.11,17.46 180 top
JP9  5.71,30.16 0 top
JP10  9.37,51.59 90 top
JP11  11.75,51.59 90 top
JP12  14.13,51.59 90 top
JP13  16.51,51.59 90 top
JP14  28.57,1.91 0 top
JP15  17.94,43.81 180 top
JP16  1.91,29.53 90 top
JP17  5.4,25.4 270 top
JP18  8.26,33.81 180 top
JP20  21.27,29.37 270 top
JP26  10.79,29.37 90 top
JP27  10.32,20 180 top
JP28  26.35,13.81 90 top
JP29  40.96,15.56 180 top
JP30  15.56,29.37 90 top
JP31  10.16,45.72 180 top
L1  9.37,40.64 0 top
L2  9.37,39.37 0 top
LED1  8.26,10.16 270 top
LED2  8.26,13.34 270 top
Q1  32.38,55.24 0 bottom
Q2  44,55.21 0 bottom
Q3  32.57,43.15 0 bottom
Q4  44,43.15 0 bottom
Q5  32.57,31.08 0 bottom
Q6  44,31.08 0 bottom
Q7  32.57,19.02 0 bottom
R1  3.81,10.79 180 top
R2  3.81,13.34 180 top
R4  3.81,8.26 180 top
R7  3.81,5.71 180 top
R8  24.77,51.44 270 top
R9  24.77,45.72 270 top
R10  24.77,40.01 270 top
R11  24.77,33.66 270 top
R13  24.77,27.3 270 top
R15  2.54,51.59 270 top
R16  4.13,51.59 90 top
R17  5.71,51.59 270 top
RLA1  32.38,52.7 0 top
RLA2  43.81,52.7 0 top
RLA3  32.38,40.64 0 top
RLA4  43.81,40.64 0 top
RLA5  32.38,28.57 0 top
RLA6  43.81,28.57 0 top
RLA7  32.38,16.51 0 top
X3  1.27,40.01 0 top

### Tracks (layer width: path | path; a pad name or v marks a point on that pad's centre or on a via)
+1V1
  Top 0.254: R15.2 R16.1 4.13,46.67 5.08,45.72 JP31.2
+3V3  (via drill 0.35)
  Top 0.2: 26.35,11.43 25.88,11.91
  Top 0.203: R1.2 2.96,11.69 3.17,11.91 v10.79,11.91 25.88,11.91 | IC3.8 45.88,14.61 44.55,13.28 C5.1 42.86,12.06 42.23,11.43 26.35,11.43
  Top 0.254: v5.71,46.51 R17.2 6.77,50.74 6.99,50.96 6.99,52.23 7.16,52.41 JP10.3 JP11.3 JP12.3 JP13.3 | v5.71,44.93 6.67,43.97 JP6.2 | C15.1 14.55,27.84 v13.18,29.21 | IC2.4 10.13,21.24 9.81,20.92 JP27.2 9.84,19.98 9.84,19.76 9.84,19.75 v9.84,18.57 | R7.2 R4.2 R1.2 | v6.99,30.16 JP9.2 | JP7.2 18.41,41.2 v18.41,39.85
  Top 0.406: IC2.4 14.41,21.24 14.61,21.43 14.61,26.61 C15.1
  Bottom 0.254: v5.71,46.51 v5.71,44.93 6.67,43.97 17.3,43.97 18.41,42.86 v18.41,39.85 18.41,30.32 17.3,29.21 v13.18,29.21 12.22,30.16 v6.99,30.16
  Bottom 0.406: JP14.1 v10.79,11.91 10.79,17.62 v9.84,18.57
+5V  (via drill 0.35)
  Top 0.254: R2.2 1.91,13.34 1.43,12.86 1.43,4.92 1.75,4.6 12.54,4.6 13.34,3.81 JP14.2
  Top 0.406: v13.97,7.94 47.62,7.94 v48.26,8.57 | v41.91,55.88 41.27,56.52 RLA2.1 39.37,56.52 38.42,57.47 31.43,57.47 30.48,56.52 RLA1.1 | RLA3.1 30.16,44.45 v30.48,44.13 | v38.42,41.27 38.42,43.8 39.07,44.45 RLA4.1 41.91,44.45 43.18,43.18 46.35,43.18 46.99,42.55 v49.53,42.55 | RLA5.1 30.48,32.38 31.75,33.66 40.01,33.66 40.46,33.2 RLA6.1 | RLA7.1 29.84,20.32 v30.16,20.64 30.8,21.27 v49.53,21.27 | v38.1,28.89 38.1,30.8 38.73,31.43 40.01,31.43 40.46,31.89 RLA6.1 | RLA6.1 41.91,32.38 43.18,33.66 v49.53,33.66
  Bottom 0.2: D7.C 31.25,16.38 30.48,17.14 30.48,20.32 v30.16,20.64
  Bottom 0.406: JP14.2 13.34,7.3 v13.97,7.94 | v48.26,8.57 49.53,9.84 v49.53,21.27 49.53,27.62 48.71,28.45 | D4.C 48.77,40.51 | 48.77,40.51 49.53,41.27 v49.53,42.55 49.53,51.75 48.71,52.58 D2.C 45.27,52.58 44.77,52.07 42.55,52.07 41.91,52.7 v41.91,55.88 41.59,56.2 38.42,56.2 38.1,55.88 38.1,53.34 37.52,52.76 D1.C | v30.48,44.13 30.48,40.96 30.93,40.51 D3.C 37.97,40.51 38.42,40.96 v38.42,41.27 | D5.C 37.65,28.45 v38.1,28.89 | 48.71,28.45 D6.C | 48.77,40.51 49.53,39.74 v49.53,33.66 49.53,29.27 48.71,28.45
ACS
  Top 0.254: IC1.7 15.06,42.37 15.24,42.55 17.14,42.55 17.53,42.16 JP7.1
AGND  (via drill 0.35)
  Top 0.152: 20,29.53 20.25,29.77 JP20.1
  Top 0.203: IC1.25 13.18,39.37 v13.02,39.37
  Top 0.406: RLA7.6 31.75,14.92 30.64,16.03 26.83,16.03 25.72,17.14 25.72,23.34 24.61,24.45 21.75,24.45 20,26.19 20,29.53
  other vias: 6.19,42.86 13.02,40.64 14.61,40.64 14.61,39.37 10.16,38.42 9.05,38.42 7.94,38.42 6.83,38.42 6.99,42.07 8.1,41.75 9.21,41.75 10.32,41.75 7.94,44.93 16.83,37.94 9.37,49.53 11.75,49.53 14.13,49.53 16.51,49.53 3.17,33.81 8.1,43.02 10.16,32.23
  pour Top: -10.79,66.04 22.7,66.04 22.7,54.61 23.18,54.13 30.16,54.13 30.32,53.98 30.32,52.7 30.16,52.55 26.67,52.55 25.88,51.75 23.18,51.75 22.7,51.28 22.7,29.53 -10.79,29.53
  pour Bottom (rank 5): 22.7,66.04 -10.79,66.04 -10.79,29.53 22.7,29.53
CTRL-V1  (via drill 0.35)
  Top 0.254: IC5.6 9.31,37.05 9.53,36.83 9.53,33.02 9.21,32.7 5.87,32.7 5.71,32.54 IC4.2 5.71,31.43 6.03,31.11 v11.11,31.11 | v17.46,31.11 v19.21,31.11
  Bottom 0.254: v11.11,31.11 v17.46,31.11 | v19.21,31.11 26.83,31.11 28.57,29.37 JP14.8
CTRL-V2
  Top 0.254: JP18.2 7.8,33.76 IC4.4
GND  (via drill 0.35)
  Top 0.203: IC5.2 5.71,36.2 5.56,36.35 2.22,36.35 1.91,36.04 1.91,32.54 2.38,32.07 v3.17,32.07
  Top 0.254: v7.46,31.91 6.52,31.91 IC4.3 | R15.1 2.54,53.98 3.81,55.24 23.18,55.24
  Bottom 0.203: v3.17,32.07 4.76,32.07 5.92,30.91
  Bottom 0.254: 5.87,29.05 5.87,30.87 5.92,30.91 6.91,31.91 v7.46,31.91
  other vias: 5.24,2.7 19.68,2.7 8.1,7.94 23.5,9.84 4.92,18.57 39.05,12.54 40.48,19.05 51.44,18.1 37.94,23.97 38.73,32.7 33.02,36.99 43.02,37.15 51.59,43.66 43.02,48.9 33.81,48.9 12.7,26.67 38.58,44.93 30.8,37.78 27.3,40.01 26.83,43.5 16.99,5.24 19.68,4.29
  pour Top (rank 6): -26.51,74.61 60.64,74.61 60.64,-13.81 -26.51,-13.81 -26.51,74.45
  pour Bottom (rank 6): 63.98,77.79 -23.18,77.79 -23.18,-10.64 63.98,-10.64 63.98,77.63
IC5  (via drill 0.35)
  Top 0.152: X3.GND@3 v3.17,42.55
  Top 0.203: X3.GND@4 v3.17,37.47
  Top 0.254: IC5.5 v7.46,36.2
  Top 0.813: X3.GND@3 4.92,42.55 6.81,40.66 C12.1 7.48,40.64 L1.1
  Bottom 0.254: v7.46,36.2 5.71,36.2 v4.45,37.47
  other vias: 1.91,37.47 1.91,42.55 4.45,42.55
  pour Bottom (rank 3, no thermals): -0.79,43.66 5.56,43.66 5.56,36.35 -0.79,36.35
LC0
  Top 0.254: IC1.22 14.06,37.12 14.91,36.27 19.22,36.27 19.93,36.98 19.93,46.84 18.58,48.19 13.56,48.19 12.86,48.9 12.86,51.28 12.54,51.59 JP11.2
LC1
  Top 0.254: IC1.21 13.56,37.04 14.74,35.86 19.39,35.86 20.34,36.81 20.34,47.01 18.75,48.6 15.72,48.6 15.24,49.07 15.24,51.28 14.92,51.59 JP12.2
LEN
  Top 0.254: IC1.20 13.15,37.96 13.15,36.88 14.58,35.45 19.55,35.45 20.75,36.64 20.75,47.18 18.92,49 18.1,49 17.46,49.64 17.46,51.28 17.14,51.59 JP13.2
LST
  Top 0.254: IC1.23 14.56,37.19 15.08,36.67 19.05,36.67 19.53,37.15 19.53,43.81 | 19.53,43.81 19.53,46.67 18.41,47.78 10.95,47.78 10.48,48.26 10.48,51.28 10.16,51.59 JP10.2 | JP15.1 19.53,43.81
N$1
  Top 0.254: LED2.A R2.1
N$2
  Top 0.254: JP6.1 C4.1 12.33,43.4 13.06,42.66 IC1.11
N$3
  Top 0.254: JP31.1 C3.1 12.86,45.72 13.18,45.4 13.18,43.18 13.56,42.8 IC1.10
N$4
  Top 0.254: IC1.15 10.86,40.26 10.48,40.64 L1.2
N$5
  Top 0.254: IC1.16 10.86,39.76 10.48,39.37 L2.2
N$6
  Top 0.406: RLA2.3 39.05,51.12 38.42,50.48 38.42,47.62 37.94,47.15 33.5,47.15 32.7,46.35 32.7,42.23 31.73,41.25 RLA3.2 29.01,41.27 26.99,41.27 26.67,40.95 R10.1 R9.2 JP2.2
N$8
  Top 0.254: JP18.1 8.59,33.89 IC5.4
N$9
  Top 0.254: C6.1 6.28,35.4 IC5.3
N$10
  Top 0.406: JP1.2 23.81,50.16 24.13,50.48 R8.2 | R8.2 26.99,50.48 27.62,51.12 RLA1.3 32.54,51.12 33.66,52.23 37.78,52.23 38.87,53.31 RLA2.2 | R9.1 R8.2
N$12
  Top 0.406: 27.44,29.18 RLA5.2 | 27.44,29.18 26.51,28.25 R13.1 R11.2 JP4.2 | 27.44,29.18 27.44,29.23 26.83,29.84 26.83,34.61 27.62,35.4 38.1,35.4 38.58,35.88 38.58,38.42 39.21,39.05 RLA4.3
N$13
  Top 0.254: IC2.5 10.86,19.97 JP27.1
N$14  (via drill 0.35)
  Top 0.254: IC4.5 4.39,33.76 4.13,33.5 4.13,31.43 4.45,31.11 5.08,31.11 5.31,30.89 JP9.1 4.5,30.16 v4.13,29.79
  Bottom 0.254: JP17.1 4.45,26.67 4.13,26.99 v4.13,29.79
N$15
  Top 0.254: IC2.8 20.57,17.43 JP8.2
N$16
  Top 0.254: IC2.9 19.5,18.7 19.68,18.89 JP5.2
N$17
  Top 0.254: R16.2 R17.1
N$20
  Top 0.254: R1.1 5.71,10.79 6.35,10.16 LED1.A
N$21
  Top 0.203: RLA7.4 32.56,12.72 33.95,14.11 IC3.4
  Top 0.406: JP28.1 27.39,13.4 28.1,12.7 29.01,12.7 RLA7.4
N$22
  Top 0.203: JP29.1 41.51,15.61 IC3.1
N$24
  Top 0.406: R10.2 R11.1 | R10.2 RLA3.3 32.86,39.05 33.81,40.01 38.58,40.01 39.21,40.64 39.21,40.96 39.5,41.25 RLA4.2 | JP3.2 R10.2
POT_A1  (via drill 0.35)
  Top 0.406: JP20.2 v21.27,27.94 21.27,26.99 21.91,26.36 R13.2 26.99,26.36 27.62,26.98 RLA5.3 33.65,26.98 34.45,27.78 37.15,27.78 37.94,26.98 RLA6.3 | IC2.1 11.78,25.05 11.43,25.4 11.43,26.35 11.43,27.46 v11.91,27.94
  Bottom 0.406: v11.91,27.94 v21.27,27.94
POT_W1  (via drill 0.35)
  Top 0.406: IC2.2 11.3,23.78 v11.27,23.81 10.79,24.29 JP26.1 | RLA6.2 41.78,29.18 42.39,28.57 42.39,23.97 41.59,23.18 v26.99,23.18
  Bottom 0.406: v26.99,23.18 11.91,23.18 v11.27,23.81
R1  (via drill 0.35)
  Top 0.254: RLA1.8 33.66,56.52 v33.5,56.36
  Top 0.406: RLA1.8 v37.62,56.52
  Bottom 0.254: v33.5,56.36 33.38,56.24 Q1.3
  Bottom 0.406: v37.62,56.52 37.57,56.46 D1.A
R1-SIG
  Bottom 0.254: JP14.15 46.35,50.64 45.56,51.44 34.13,51.44 33.34,52.23 Q1.1
R2  (via drill 0.35)
  Top 0.254: RLA2.8 45.4,56.52 v45.09,56.2
  Top 0.406: RLA2.8 v48.9,56.52
  Bottom 0.254: v45.09,56.2 44.01,56.2 Q2.3
  Bottom 0.406: v48.9,56.52 48.66,56.27 D2.A
R2-SIG  (via drill 0.35)
  Top 0.254: v44.77,50.78 44.74,50.8 44.29,50.8 43.97,51.12 43.97,52.7 v44.29,53.02
  Bottom 0.254: v44.77,50.78 44.77,50.8 44.93,50.96 45.46,50.96 45.95,50.47 45.95,4.51 44.61,3.17 44.13,3.17 43.81,2.86 JP14.14 | v44.29,53.02 44.61,53.02 44.95,53.36 Q2.1
R3  (via drill 0.35)
  Top 0.254: RLA3.8 34.13,44.45 v33.81,44.13
  Top 0.406: RLA3.8 v37.47,44.45
  Bottom 0.254: v33.81,44.13 32.58,44.13 Q3.3
  Bottom 0.406: v37.47,44.45 37.23,44.21 D3.A
R3-SIG
  Bottom 0.254: JP14.13 41.27,2.86 41.59,3.17 43.56,3.17 43.96,3.58 44.32,3.58 45.54,4.8 45.54,5.79 45.54,5.87 45.54,26.71 44.47,27.78 42.39,27.78 41.43,28.73 41.43,41.43 40.72,42.15 Q3.1
R4  (via drill 0.35)
  Top 0.254: RLA4.8 45.4,44.45 v45.09,44.13
  Top 0.406: RLA4.8 v48.58,44.45
  Bottom 0.254: v45.09,44.13 44.01,44.13 Q4.3
  Bottom 0.406: v48.58,44.45 48.34,44.21 D4.A
R4-SIG  (via drill 0.35)
  Top 0.254: v42.23,40.16 v40.48,40.16
  Bottom 0.254: Q4.1 44.93,42.12 44.93,40.8 44.29,40.16 v42.23,40.16 | v40.48,40.16 41.03,39.62 41.03,28.57 42.22,27.38 44.3,27.38 45.14,26.54 45.14,4.97 44.15,3.99 43.8,3.99 43.39,3.58 41.42,3.58 41.02,3.17 39.05,3.17 38.73,2.86 JP14.12
R5  (via drill 0.35)
  Top 0.254: RLA5.8 33.97,32.38 v33.66,32.07
  Top 0.406: RLA5.8 v37.47,32.38
  Bottom 0.254: v33.66,32.07 32.58,32.07 Q5.3
  Bottom 0.406: v37.47,32.38 37.23,32.15 D5.A
R5-SIG
  Bottom 0.254: JP14.11 36.2,2.86 36.51,3.17 38.48,3.17 38.88,3.58 40.85,3.58 41.26,3.99 43.22,3.99 43.63,4.39 43.98,4.39 44.73,5.14 44.73,26.37 44.13,26.97 42.05,26.97 40.62,28.4 40.62,29.7 40.16,30.16 33.6,30.16 Q5.1
R6  (via drill 0.35)
  Top 0.254: RLA6.8 45.4,32.38 v45.09,32.07
  Top 0.406: RLA6.8 v48.58,32.38
  Bottom 0.254: v45.09,32.07 44.01,32.07 Q6.3
  Bottom 0.406: v48.58,32.38 48.34,32.15 D6.A
R6-SIG  (via drill 0.35)
  Top 0.254: v44.07,26.04 44.07,28.36 v44.61,28.89
  Bottom 0.254: JP14.10 33.66,2.86 33.97,3.17 35.94,3.17 36.34,3.58 38.31,3.58 38.72,3.99 40.68,3.99 41.09,4.39 43.05,4.39 43.46,4.8 43.81,4.8 44.32,5.31 44.32,25.53 44.07,25.78 v44.07,26.04 | v44.61,28.89 44.95,29.23 Q6.1
R7  (via drill 0.35)
  Top 0.254: RLA7.8 33.97,20.32 v33.66,20
  Top 0.406: RLA7.8 v37.47,20.32
  Bottom 0.254: v33.66,20 32.58,20 Q7.3
  Bottom 0.406: v37.47,20.32 37.23,20.08 D7.A
R7-SIG
  Bottom 0.254: JP14.9 31.11,2.86 31.43,3.17 33.4,3.17 33.8,3.58 35.77,3.58 36.18,3.99 38.14,3.99 38.55,4.39 40.51,4.39 40.92,4.8 42.88,4.8 43.29,5.21 43.65,5.21 43.92,5.48 43.92,17.68 43.5,18.1 33.6,18.1 Q7.1
RF2
  Top 0.254: IC5.1 6.03,37.35 6.03,39.12 6.27,39.35
  Top 0.813: L2.1 8.84,39.35 C12.2 6.27,39.35 5.62,40.01 X3.P
SCL  (via drill 0.35)
  Top 0.203: IC3.10 49.03,15.61 49.89,14.75 49.89,5.73 49.2,5.04 21.39,5.04 v20.95,4.6
  Top 0.254: R4.1 5.4,8.26 5.87,7.78 5.87,5.97 6.43,5.42 12.88,5.42 14.4,3.9 17.95,3.9 18.36,3.49 20.16,3.49 20.95,2.7 JP14.5 | IC2.6 14.79,18.7 15.88,17.62 15.88,16.83 16.35,16.35 v16.35,16.19
  Bottom 0.203: v20.95,4.6 JP14.5
  Bottom 0.254: v16.35,16.19 16.35,16.03 15.65,15.33 15.65,7.47 16.04,7.07 19.38,7.07 19.93,6.52 19.93,5.94 20.95,4.92 v20.95,4.6
SDA  (via drill 0.35)
  Top 0.203: IC3.9 47.58,15.08 49.05,15.08 49.53,14.61 49.53,5.87 49.05,5.4 v19.53,5.4
  Top 0.254: R7.1 5.56,5.71 6.26,5.01 12.71,5.01 14.23,3.49 17.78,3.49 18.41,2.86 JP14.4 | IC2.7 14.64,17.43 15.24,16.83 v15.24,16.19
  Bottom 0.203: v19.53,5.4 18.41,4.29 JP14.4
  Bottom 0.254: v15.24,16.19 15.24,7.3 15.88,6.67 19.21,6.67 19.53,6.35 v19.53,5.4
VDDA
  Top 0.203: JP16.1 1.91,16.35 2.86,15.4 23.81,15.4 24.99,14.22 JP28.2
  Top 0.254: IC1.18 11.29,38.76 11.11,38.58 11.11,36.51 11.69,35.93 C2.1
  Top 0.406: C2.1 C1.1 11.69,31.81 11.91,31.59 11.91,30 11.68,29.77 JP26.2 9.61,29.77 8.89,29.05 2.7,29.05 JP16.1 | RLA7.3 28.1,14.92 27.39,14.22 JP28.2
VOK
  Top 0.254: IC1.8 14.56,42.66 15.72,43.81 JP15.2

### Text on the board
tPlace: NXP harvester energy profiler | RELAY 1 | RELAY 2 | V1.1 | LIMITER | Create +1V1 | LST | LC0 | LC1 | LEN | RELAY 3 | RELAY 4 | RELAY 5 | RELAY 6 | AGND | VDDA | POT-VDDA | VCC / MOD | GND / MOD | RELAY 7 | SHDN | AD1 | AD0 | +5V | VDDA-ADC | +3V3 | Jarne Van Mulders | Researcher KU Leuven | +3V3 | +5V | GND | SDA | SCL | GND | P02 | P03 | P04 | P19 | P17 | p14 | P13 | P12 | P11